# Altium project PCB_lampe.PrjPCB
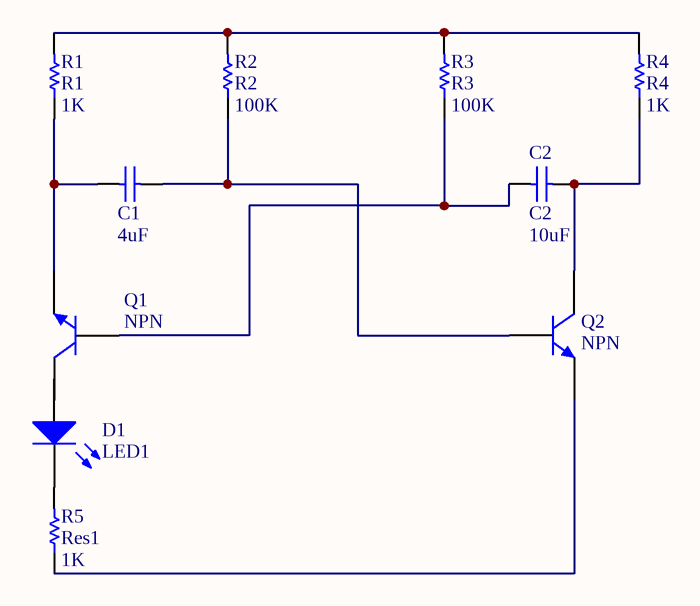
[diagram p0: Schematic_lampe.SchDoc]
1 sheet, 10 parts. Net scope: global (net labels, ports and power ports of the same name join across sheets).

## Sheet Schematic_lampe.SchDoc
size A4

### Parts
C1  C1  value 4uF  [RAD-0.3]
C2  C2  value 10uF  [RAD-0.3]
D1  LED1  [LED-1]
Q1  NPN  [TO-226-AA]
Q2  NPN  [TO-226-AA]
R1  R1  value 1K  [AXIAL-0.3]
R2  R2  value 100K  [AXIAL-0.3]
R3  R3  value 100K  [Resistor 1206]
R4  R4  value 1K  [AXIAL-0.3]
R5  Res1  value 1K  [AXIAL-0.3]

### Nets
NetC1_1: C1.1 Q1.3(E) R1.1
NetC1_2: C1.2 Q2.2(B) R2.1
NetC2_1: C2.1 Q1.2(B) R3.1
NetC2_2: C2.2 Q2.1(C) R4.1
NetD1_2: D1.2(K) R5.2
NetQ2_3: Q2.3(E) R5.1
NetR1_2: R1.2 R2.2 R3.2 R4.2

Not connected (* = marked no-connect by the designer): D1 1(A); Q1 1(C)

### Library data of the parts
C1 C2 = Cap: Capacitor; Published: 8-Jun-2000; LatestRevisionDate: 17-Jul-2002; LatestRevisionNote: Re-released for DXP Platform.; PackageReference: RAD-0.3; Publisher: Altium Limited; PackageDescription: Radial Cap, Thru-Hole; 2 Leads; 0.3 in Pin Spacing
D1 = LED1: Typical RED GaAs LED; Published: 8-Jun-2000; LatestRevisionDate: 08-Jul-2005; LatestRevisionNote: Mech Layer 1 removed.; PackageReference: LED-1; Publisher: Altium Limited; PackageDescription: LED; 2 Leads
Q1 Q2 = NPN: NPN Bipolar Transistor; Published: 8-Jun-2000; LatestRevisionDate: 17-Jul-2002; LatestRevisionNote: Re-released for DXP Platform.; PackageReference: TO-226-AA; Publisher: Altium Limited; PackageDescription: TO, Flat Index; 3 In-Line, Axial Leads; Body Dia. 4.8mm; Leads 0.55 x 0.51 mm (max); Code_JEDEC: TO-226-AA
R1-R5 = Res1: Resistor; Published: 8-Jun-2000; LatestRevisionDate: 17-Jul-2002; LatestRevisionNote: Re-released for DXP Platform.; PackageReference: AXIAL-0.3; Publisher: Altium Limited; PackageDescription: Axial Device, Thru-Hole; 2 Leads; 0.3 in Pin Spacing